# Altium schematic sheet 条形灯-modifi.SchDoc
size A4
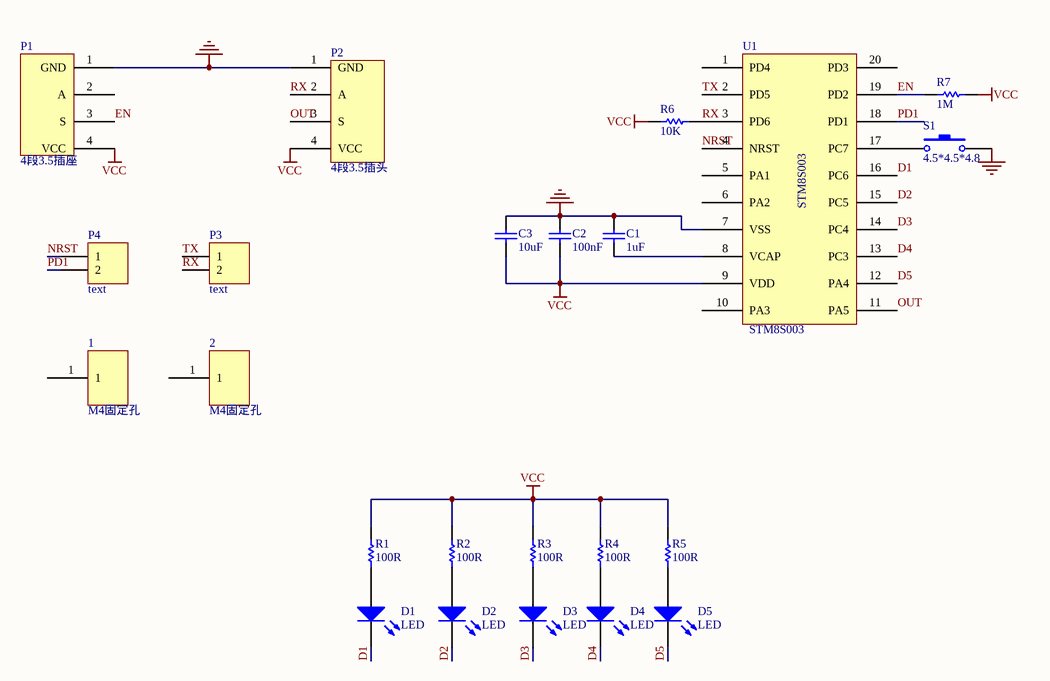
[diagram p0: 条形灯-modifi.SchDoc]

## Parts
1  M4固定孔  [M4固定孔]
2  M4固定孔  [M4固定孔]
C1  1uF  [0603C]
C2  100nF  [0603C]
C3  10uF  [0603C]
D1  LED  [3528LED]
D2  LED  [3528LED]
D3  LED  [3528LED]
D4  LED  [3528LED]
D5  LED  [3528LED]
P1  4段3.5插座  [4段3.5耳机贴片座]
P2  4段3.5插头  [4段3.5插头]
P3  text  [2SMT-2.54]
P4  text  [2SMT-2.54]
R1  100R  [0603R]
R2  100R  [0603R]
R3  100R  [0603R]
R4  100R  [0603R]
R5  100R  [0603R]
R6  10K  [0603R]
R7  1M  [0603R]
S1  4.5*4.5*4.8  [按键4.5*4.5*4.8]
U1  STM8S003  [TSSOP20]

## Nets
GND: C1.2 C2.2 C3.2 P1.1(GND) P2.1(GND) S1.2 U1.7(VSS)
VCC: C2.1 C3.1 P1.4(VCC) P2.4(VCC) R1.2 R2.2 R3.2 R4.2 R5.2 R6.2 R7.1 U1.9(VDD)
D1: D1.2(K) U1.16(PC6)
D2: D2.2(K) U1.15(PC5)
D3: D3.2(K) U1.14(PC4)
D4: D4.2(K) U1.13(PC3)
D5: D5.2(K) U1.12(PA4)
EN: P1.3(S) R7.2 U1.19(PD2)
NRST: P4.1 U1.4(NRST)
OUT: P2.3(S) U1.11(PA5)
PD1: P4.2 U1.18(PD1)
RX: P2.2(A) P3.2 R6.1 U1.3(PD6)
TX: P3.1 U1.2(PD5)
NetC1_1: C1.1 U1.8(VCAP)
NetD1_1: D1.1(A) R1.1
NetD2_1: D2.1(A) R2.1
NetD3_1: D3.1(A) R3.1
NetD4_1: D4.1(A) R4.1
NetD5_1: D5.1(A) R5.1
NetS1_1: S1.1 U1.17(PC7)

Not connected (* = marked no-connect by the designer): 1 1; 2 1; P1 2(A); U1 1(PD4) 5(PA1) 6(PA2) 10(PA3) 20(PD3)

## Library data of the parts
C1-C3 = Cap: Capacitor; Value: 100pF; Published: 8-Jun-2000; LatestRevisionDate: 17-Jul-2002; LatestRevisionNote: Re-released for DXP Platform.; PackageReference: RAD-0.3; Publisher: Altium Limited; PackageDescription: Radial Cap, Thru-Hole; 2 Leads; 0.3 in Pin Spacing
D1-D5 = LED0: Typical INFRARED GaAs LED; Published: 8-Jun-2000; LatestRevisionDate: 08-Jul-2005; LatestRevisionNote: Mech Layer 1 removed.; PackageReference: LED-0; Publisher: Altium Limited; PackageDescription: LED; 2 Leads
P3 P4 = Header 2: Header, 2-Pin; LatestRevisionDate: 17-Jul-2002; LatestRevisionNote: Re-released for DXP Platform.; Publisher: Altium Limited
R1-R7 = Res1: Resistor; Value: 1K; Published: 8-Jun-2000; LatestRevisionDate: 17-Jul-2002; LatestRevisionNote: Re-released for DXP Platform.; PackageReference: AXIAL-0.3; Publisher: Altium Limited; PackageDescription: Axial Device, Thru-Hole; 2 Leads; 0.3 in Pin Spacing
S1 = SW-PB: Switch; Published: 24-Mar-1999; LatestRevisionDate: 17-Jul-2002; LatestRevisionNote: Re-released for DXP Platform.; PackageReference: SPST-2; Publisher: Altium Limited; PackageDescription: Switch; 2 Leads